# EAGLE design ultraino6edit (EAGLE 8.3.2)
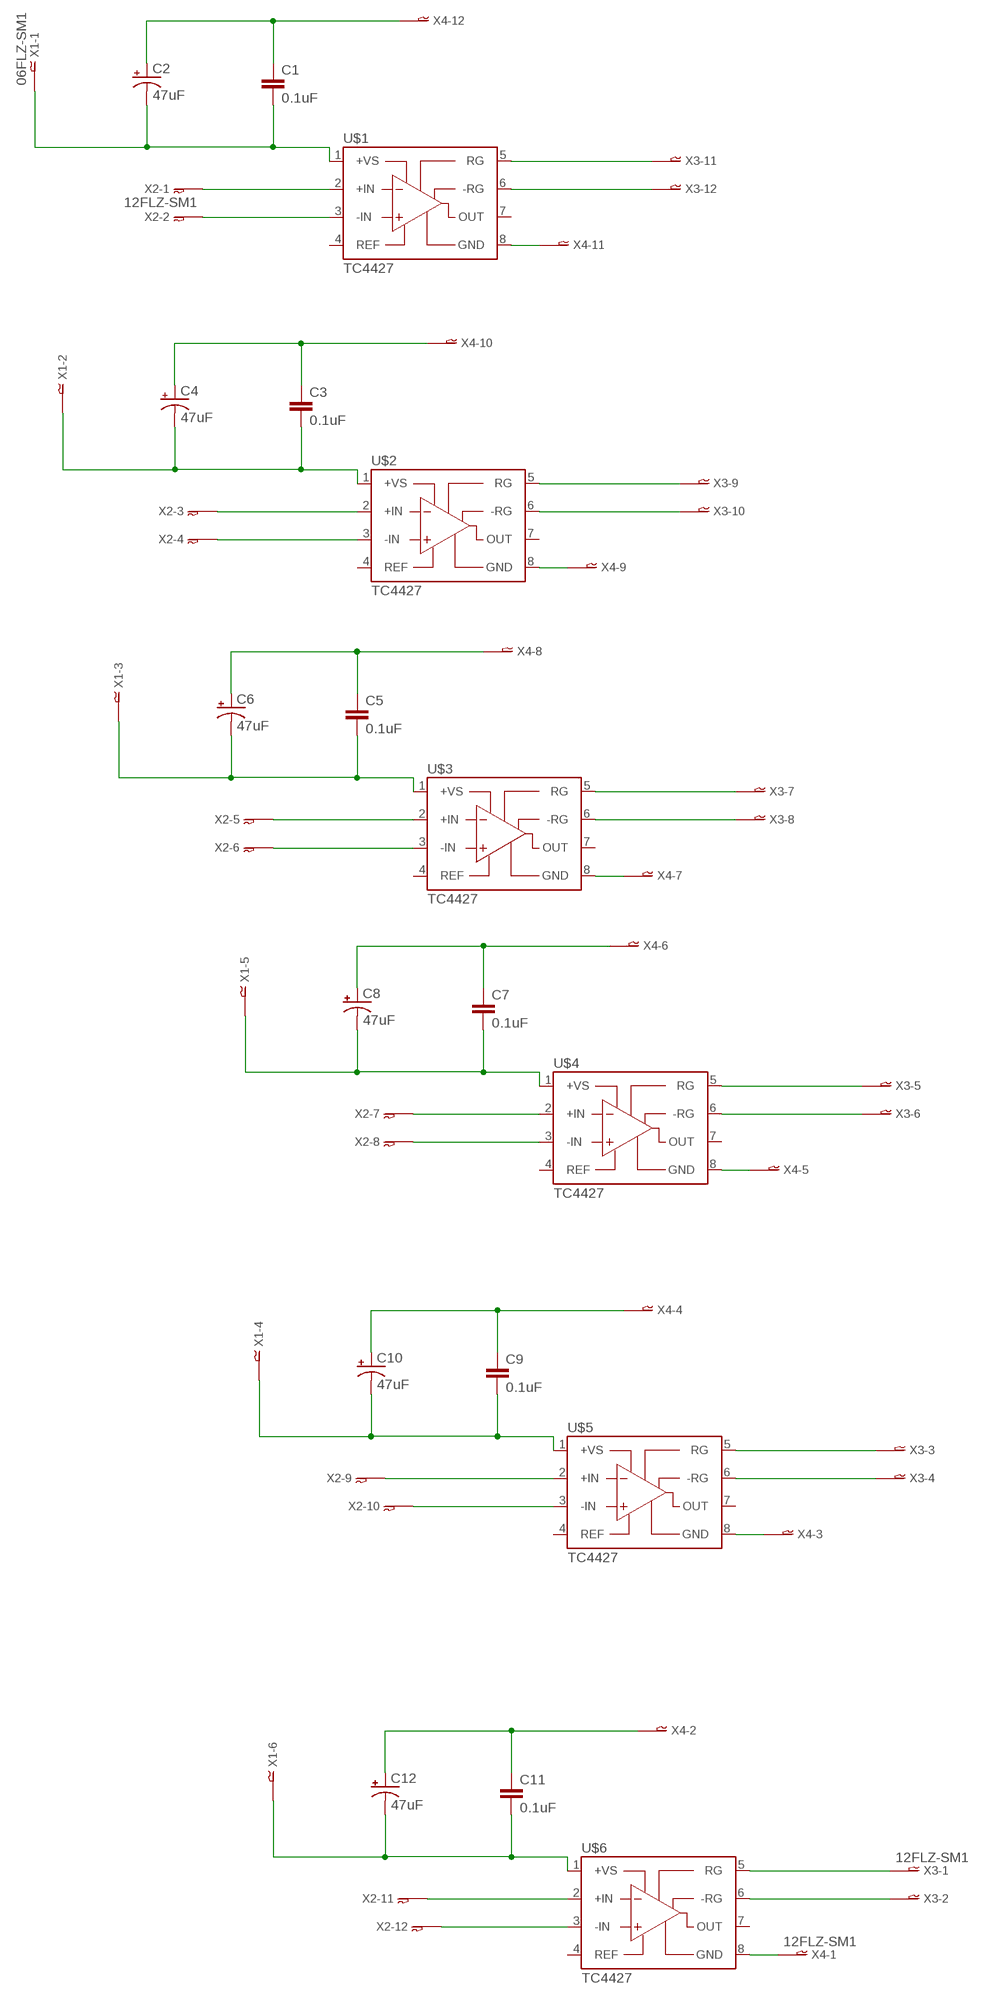
[diagram p0: schematic, sheet 1]

## Parts
C1  0.1uF  0.1UF-0402-16V-10%  [0402]
C2  47uF  47UF-POLAR-EIA3528-10V-10%  [EIA3528]
C3  0.1uF  0.1UF-0402-16V-10%  [0402]
C4  47uF  47UF-POLAR-EIA3528-10V-10%  [EIA3528]
C5  0.1uF  0.1UF-0402-16V-10%  [0402]
C6  47uF  47UF-POLAR-EIA3528-10V-10%  [EIA3528]
C7  0.1uF  0.1UF-0402-16V-10%  [0402]
C8  47uF  47UF-POLAR-EIA3528-10V-10%  [EIA3528]
C9  0.1uF  0.1UF-0402-16V-10%  [0402]
C10  47uF  47UF-POLAR-EIA3528-10V-10%  [EIA3528]
C11  0.1uF  0.1UF-0402-16V-10%  [0402]
C12  47uF  47UF-POLAR-EIA3528-10V-10%  [EIA3528]
U$1  TC4427  [SOIC-8]
U$2  TC4427  [SOIC-8]
U$3  TC4427  [SOIC-8]
U$4  TC4427  [SOIC-8]
U$5  TC4427  [SOIC-8]
U$6  TC4427  [SOIC-8]
X1  06FLZ-SM1  [6FLZ-SM]
X2  12FLZ-SM1  [12FLZ-SM]
X3  12FLZ-SM1  [12FLZ-SM]
X4  12FLZ-SM1  [12FLZ-SM]

## Nets
N$1 [GND]: U$1.2(+IN) X2.1
N$2: U$1.3(-IN) X2.2
N$3: U$1.5(RG) X3.11
N$4: U$1.6(-RG) X3.12
N$5 [GND]: U$2.2(+IN) X2.3
N$6: U$2.5(RG) X3.9
N$7: U$2.6(-RG) X3.10
N$8: U$2.3(-IN) X2.4
N$9 [GND]: U$3.2(+IN) X2.5
N$10: U$3.5(RG) X3.7
N$11: U$3.6(-RG) X3.8
N$12: U$3.3(-IN) X2.6
N$13 [GND]: U$4.2(+IN) X2.7
N$14: U$4.5(RG) X3.5
N$15: U$4.6(-RG) X3.6
N$16: U$4.3(-IN) X2.8
N$17 [GND]: U$5.2(+IN) X2.9
N$18: U$5.5(RG) X3.3
N$19: U$5.6(-RG) X3.4
N$20: U$5.3(-IN) X2.10
N$21 [GND]: U$6.2(+IN) X2.11
N$22: U$6.5(RG) X3.1
N$23: U$6.6(-RG) X3.2
N$24: U$6.3(-IN) X2.12
N$25 [GND]: C1.2 C2.C(-) U$1.1(+VS) X1.1
N$26 [GND]: C3.2 C4.C(-) U$2.1(+VS) X1.2
N$27 [GND]: C5.2 C6.C(-) U$3.1(+VS) X1.3
N$28 [GND]: C11.2 C12.C(-) U$6.1(+VS) X1.6
N$29 [GND]: C9.2 C10.C(-) U$5.1(+VS) X1.4
N$30 [GND]: C7.2 C8.C(-) U$4.1(+VS) X1.5
N$31 [GND]: C1.1 C2.A(+) X4.12
N$32 [GND]: U$1.8(GND) X4.11
N$33 [GND]: C3.1 C4.A(+) X4.10
N$34 [GND]: U$2.8(GND) X4.9
N$35 [GND]: C5.1 C6.A(+) X4.8
N$36 [GND]: U$3.8(GND) X4.7
N$37 [GND]: C7.1 C8.A(+) X4.6
N$38 [GND]: U$4.8(GND) X4.5
N$39 [GND]: C9.1 C10.A(+) X4.4
N$40 [GND]: U$5.8(GND) X4.3
N$41 [GND]: C11.1 C12.A(+) X4.2
N$42 [GND]: U$6.8(GND) X4.1
Unconnected: U$1.4(REF) U$1.7(OUT) U$2.4(REF) U$2.7(OUT) U$3.4(REF) U$3.7(OUT) U$4.4(REF) U$4.7(OUT) U$5.4(REF) U$5.7(OUT) U$6.4(REF) U$6.7(OUT)

## Library data of the parts
C1 C3 C5 C7 C9 C11 = capacitor:0.1UF: 0.1�F ceramic capacitors A capacitor is a passive two-terminal electrical component used to store electrical energy temporarily in an electric field.; PROD_ID: CAP-12416
C2 C4 C6 C8 C10 C12 = capacitor:47UF-POLAR: 47�F polarized capacitors A capacitor is a passive two-terminal electrical component used to store electrical energy temporarily in an electric field.; PROD_ID: CAP-08310
U$1-U$6 = example:TC4427
X1 = con-jst:06FLZ-SM1: CONNECTOR; OC_FARNELL: unknown; OC_NEWARK: unknown
X2-X4 = con-jst:12FLZ-SM1: CONNECTOR; OC_FARNELL: unknown; OC_NEWARK: unknown

## Net classes
1 GND: width 0.635 mm

## Board
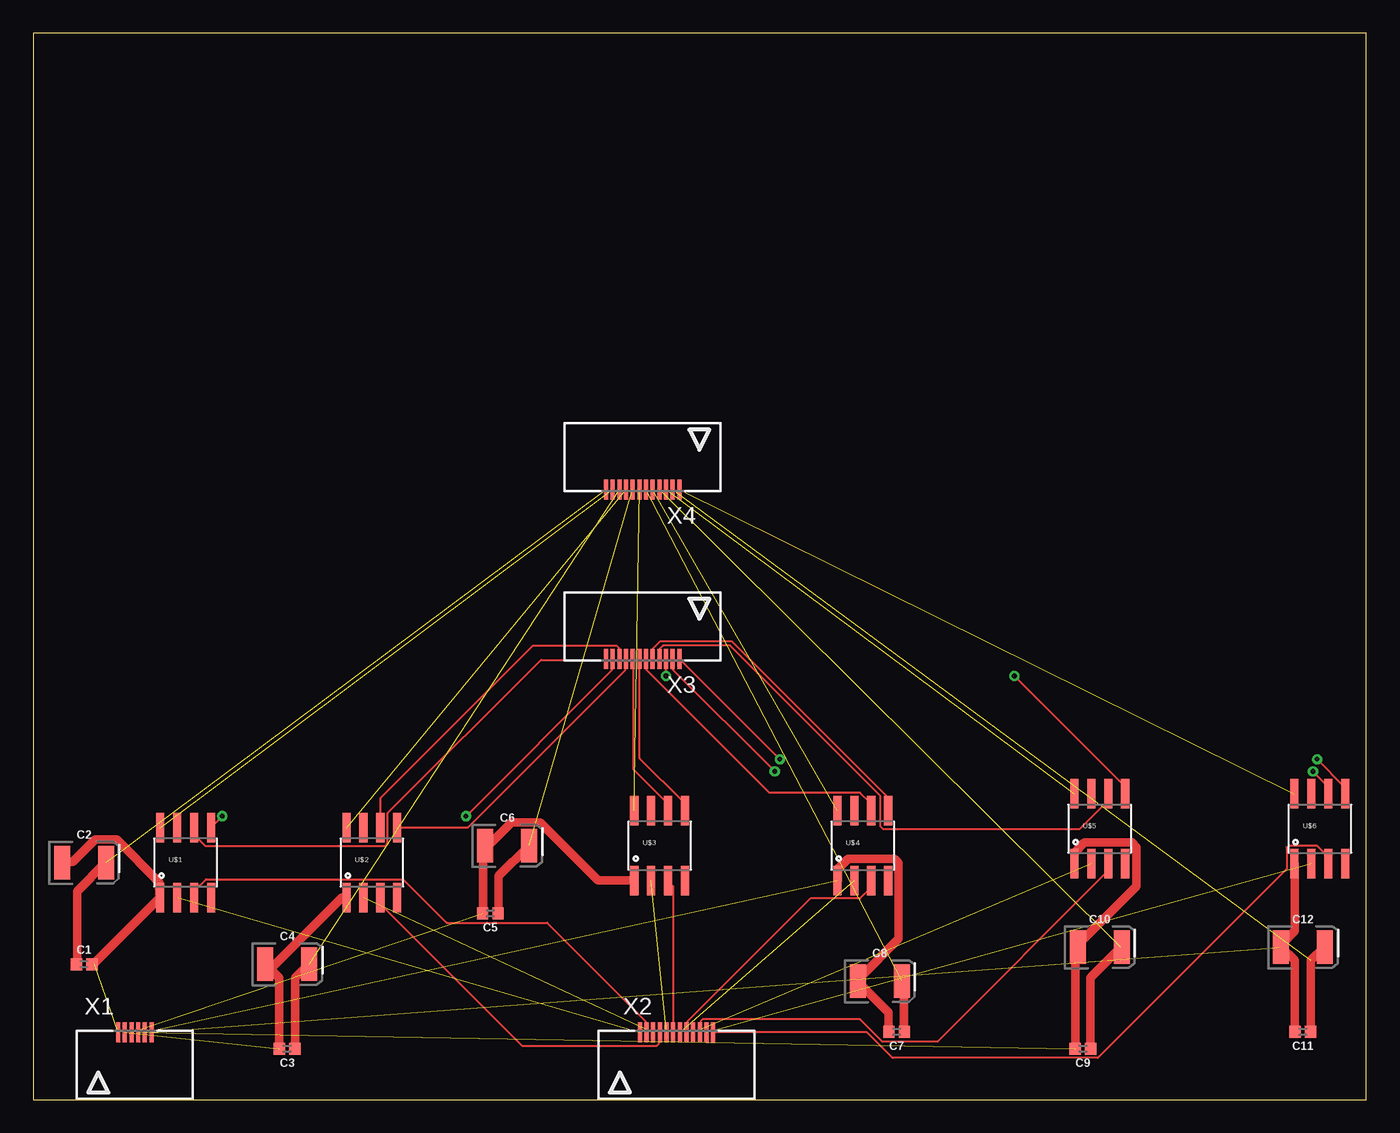
[diagram p1: board, top side]
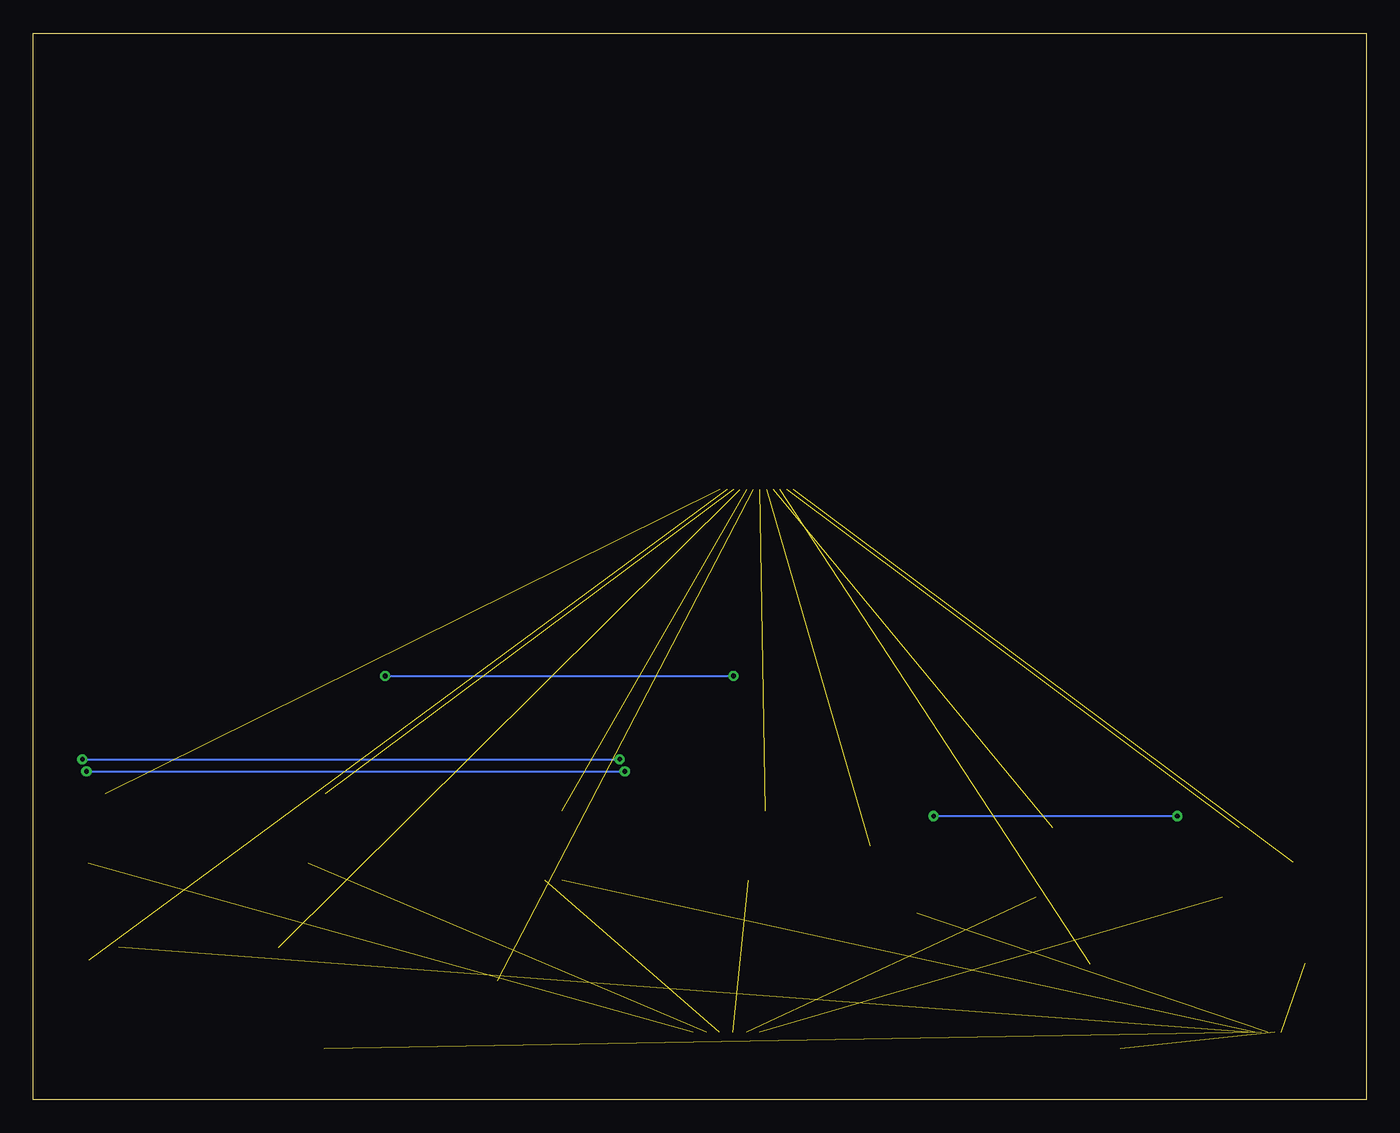
[diagram p2: board, bottom side, seen from below]

Size 100 x 80 mm. Coordinates in mm from the lower left corner, seen from the top.
Outline: 0,0 100,0 100,80 0,80 0,0
Copper layers (1*16): Top 0.035mm / dielectric 1.5mm / Bottom 0.035mm
Design rules "default": minimum track width 6mil, minimum drill 0.35mm, track to track 6mil, track to pad 6mil, pad to pad 6mil, via to via 6mil, smd to smd 6mil, copper to edge 40mil, drill to drill 6mil, minimum pad ring 10mil, minimum via ring 8mil, stop-mask expansion 4mil, vias tented up to drill 0mil, thermal gap 10mil

### Footprints (pad centres in the part's own frame; a part is rotated, then mirrored left to right if it is on the bottom)
0402 = smd 0.85 x 0.9: 1 -0.58,0; 2 0.58,0
EIA3528 = smd 1.2 x 2.5: A 1.65,0; C -1.65,0
SOIC-8 = smd 0.61 x 2.21: 1 -1.905,-2.616; 2 -0.635,-2.616; 3 0.635,-2.616; 4 1.905,-2.616; 5 1.905,2.616; 6 0.635,2.616; 7 -0.635,2.616; 8 -1.905,2.616
6FLZ-SM = smd 0.3 x 1.5: 1 -1.25,2.5; 2 -0.75,2.5; 3 -0.25,2.5; 4 0.25,2.5; 5 0.75,2.5; 6 1.25,2.5
12FLZ-SM = smd 0.3 x 1.5: 1 -2.75,2.5; 2 -2.25,2.5; 3 -1.75,2.5; 4 -1.25,2.5; 5 -0.75,2.5; 6 -0.25,2.5; 7 0.25,2.5; 8 0.75,2.5; 9 1.25,2.5; 10 1.75,2.5; 11 2.25,2.5; 12 2.75,2.5

### Placement (x,y rotation side)
C1  3.81,10.16 0 top
C2  3.81,17.78 0 top
C3  19.05,3.81 180 top
C4  19.05,10.16 0 top
C5  34.29,13.97 180 top
C6  35.56,19.05 0 top
C7  64.77,5.08 180 top
C8  63.5,8.89 0 top
C9  78.74,3.81 180 top
C10  80.01,11.43 0 top
C11  95.25,5.08 180 top
C12  95.25,11.43 0 top
U$1  11.43,17.78 0 top
U$2  25.4,17.78 0 top
U$3  46.99,19.05 0 top
U$4  62.23,19.05 0 top
U$5  80.01,20.32 0 top
U$6  96.52,20.32 0 top
X1  7.62,2.54 0 top
X2  48.26,2.54 0 top
X3  45.72,35.56 180 top
X4  45.72,48.26 180 top

### Tracks (layer width: path | path; a pad name or v marks a point on that pad's centre or on a via)
N$1  (1 unrouted)
N$2
  Top 0.152: X2.2 45.95,5.11 45.95,5.87 38.56,13.26 31.01,13.26 27.74,16.54 12.95,16.54 12.12,15.7 12.12,15.16 U$1.3
N$3  (via drill 0.35)
  Top 0.152: v32.46,21.26 43.43,32.23 43.43,32.99 X3.11 | v14.17,21.26 13.34,20.42 U$1.5
  Bottom 0.152: v14.17,21.26 v32.46,21.26
N$4
  Top 0.152: X3.12 42.9,32.99 38.1,32.99 26.59,21.49 26.59,19.2 26.44,19.05 12.88,19.05 12.12,19.81 12.12,20.34 U$1.6
N$5  (1 unrouted)
N$6
  Top 0.152: X3.9 44.42,32.99 44.42,32.23 32.61,20.42 27.36,20.42 U$2.5
N$7
  Top 0.152: X3.10 43.97,33.83 43.74,34.06 37.49,34.06 26.06,22.63 26.06,20.42 U$2.6
N$8
  Top 0.152: X2.4 46.94,5.03 46.94,4.19 46.79,4.04 36.65,4.04 26.06,14.63 26.06,15.16 U$2.3
N$9  (1 unrouted)
N$10
  Top 0.152: X3.7 45.49,32.99 45.49,25.6 48.84,22.25 48.84,21.72 U$3.5
N$11
  Top 0.152: U$3.6 47.62,22.17 45.03,24.77 45.03,32.99 X3.8
N$12
  Top 0.152: X2.6 48.01,5.11 48.01,16 47.62,16.38 U$3.3
N$13  (1 unrouted)
N$14
  Top 0.152: X3.5 46.48,33.07 46.48,33.83 47.02,34.37 52.43,34.37 64.08,22.71 64.08,21.72 U$4.5
N$15
  Top 0.152: U$4.6 62.87,22.17 62.03,23.01 55.24,23.01 46.02,32.23 46.02,32.99 X3.6
N$16
  Top 0.152: U$4.3 62.87,15.93 62.03,15.09 58.29,15.09 49.07,5.87 49.07,5.11 X2.8
N$17  (1 unrouted)
N$18  (via drill 0.35)
  Top 0.152: v47.47,31.77 47.47,32.99 X3.3 | v73.61,31.77 81.92,23.47 U$5.5
  Bottom 0.152: v73.61,31.77 v47.47,31.77
N$19
  Top 0.152: X3.4 47.02,33.07 47.02,33.83 47.24,34.06 52.27,34.06 63.55,22.78 63.55,20.5 63.78,20.27 78.49,20.27 80.62,22.4 80.62,22.94 U$5.6
N$20
  Top 0.152: X2.10 50.06,5.11 50.06,5.87 50.22,6.02 62.03,6.02 63.7,4.34 67.82,4.34 80.62,17.14 80.62,17.68 U$5.3
N$21  (1 unrouted)
N$22  (via drill 0.35)
  Top 0.152: v56.01,25.53 48.54,32.99 X3.1 | v96.32,25.53 98.37,23.47 98.37,22.94 U$6.5
  Bottom 0.152: v96.32,25.53 v56.01,25.53
N$23  (via drill 0.35)
  Top 0.152: v55.63,24.61 48.01,32.23 48.01,32.99 X3.2 | v96.01,24.61 97.16,23.47 U$6.6
  Bottom 0.152: v96.01,24.61 v55.63,24.61
N$24
  Top 0.152: U$6.3 97.16,18.21 96.32,19.05 94.18,19.05 94.03,18.9 94.03,17.3 79.86,3.12 64.47,3.12 62.56,5.03 51.05,5.03 X2.12
N$25  (1 unrouted)
  Top 0.635: C1.2 4.42,10.21 4.57,10.21 U$1.1 9.45,15.47 9.45,16.31 6.25,19.51 4.65,19.51 2.97,17.83 2.21,17.83 C2.C
N$26  (1 unrouted)
  Top 0.635: C3.2 18.44,3.81 18.44,9.14 17.45,10.13 C4.C 17.98,9.98 23.16,15.16 U$2.1
N$27  (1 unrouted)
  Top 0.635: C5.2 33.76,14.02 33.76,18.9 C6.C 34.21,19.13 35.89,20.8 38.02,20.8 42.37,16.46 45.03,16.46 U$3.1
N$28  (1 unrouted)
  Top 0.635: C11.2 94.64,5.11 94.64,10.44 93.65,11.43 C12.C 93.73,11.73 94.64,12.65 94.64,17.68 U$6.1
N$29  (1 unrouted)
  Top 0.635: C9.2 78.18,3.81 78.18,11.28 78.33,11.43 C10.C 78.49,11.73 82.75,16 82.75,18.97 82.45,19.28 78.87,19.28 78.11,18.52 U$5.1
N$30  (1 unrouted)
  Top 0.635: C7.2 64.16,5.11 64.16,6.55 61.87,8.84 C8.C 62.03,9.14 64.92,12.04 64.92,17.75 64.62,18.06 61.11,18.06 60.35,17.3 60.35,16.46 U$4.1
N$31  (1 unrouted)
  Top 0.635: C1.1 3.28,10.21 3.28,15.62 5.41,17.75 C2.A
N$32  (1 unrouted)
N$33  (1 unrouted)
  Top 0.635: C3.1 19.66,3.81 19.66,9.14 20.65,10.13 C4.A
N$34  (1 unrouted)
N$35  (1 unrouted)
  Top 0.635: C5.1 34.9,14.02 34.9,16.76 37.19,19.05 C6.A
N$36  (1 unrouted)
N$37  (1 unrouted)
  Top 0.635: C7.1 65.3,5.11 65.3,8.69 65.15,8.84 C8.A
N$38  (1 unrouted)
N$39  (1 unrouted)
  Top 0.635: C9.1 79.32,9.14 81.61,11.43 C10.A
N$40  (1 unrouted)
N$41  (1 unrouted)
  Top 0.635: C11.1 95.86,5.11 95.86,10.44 96.85,11.43 C12.A
N$42  (1 unrouted)